# EAGLE design CMoy-Pro-V_2_0_0_0a (EAGLE 6.4)
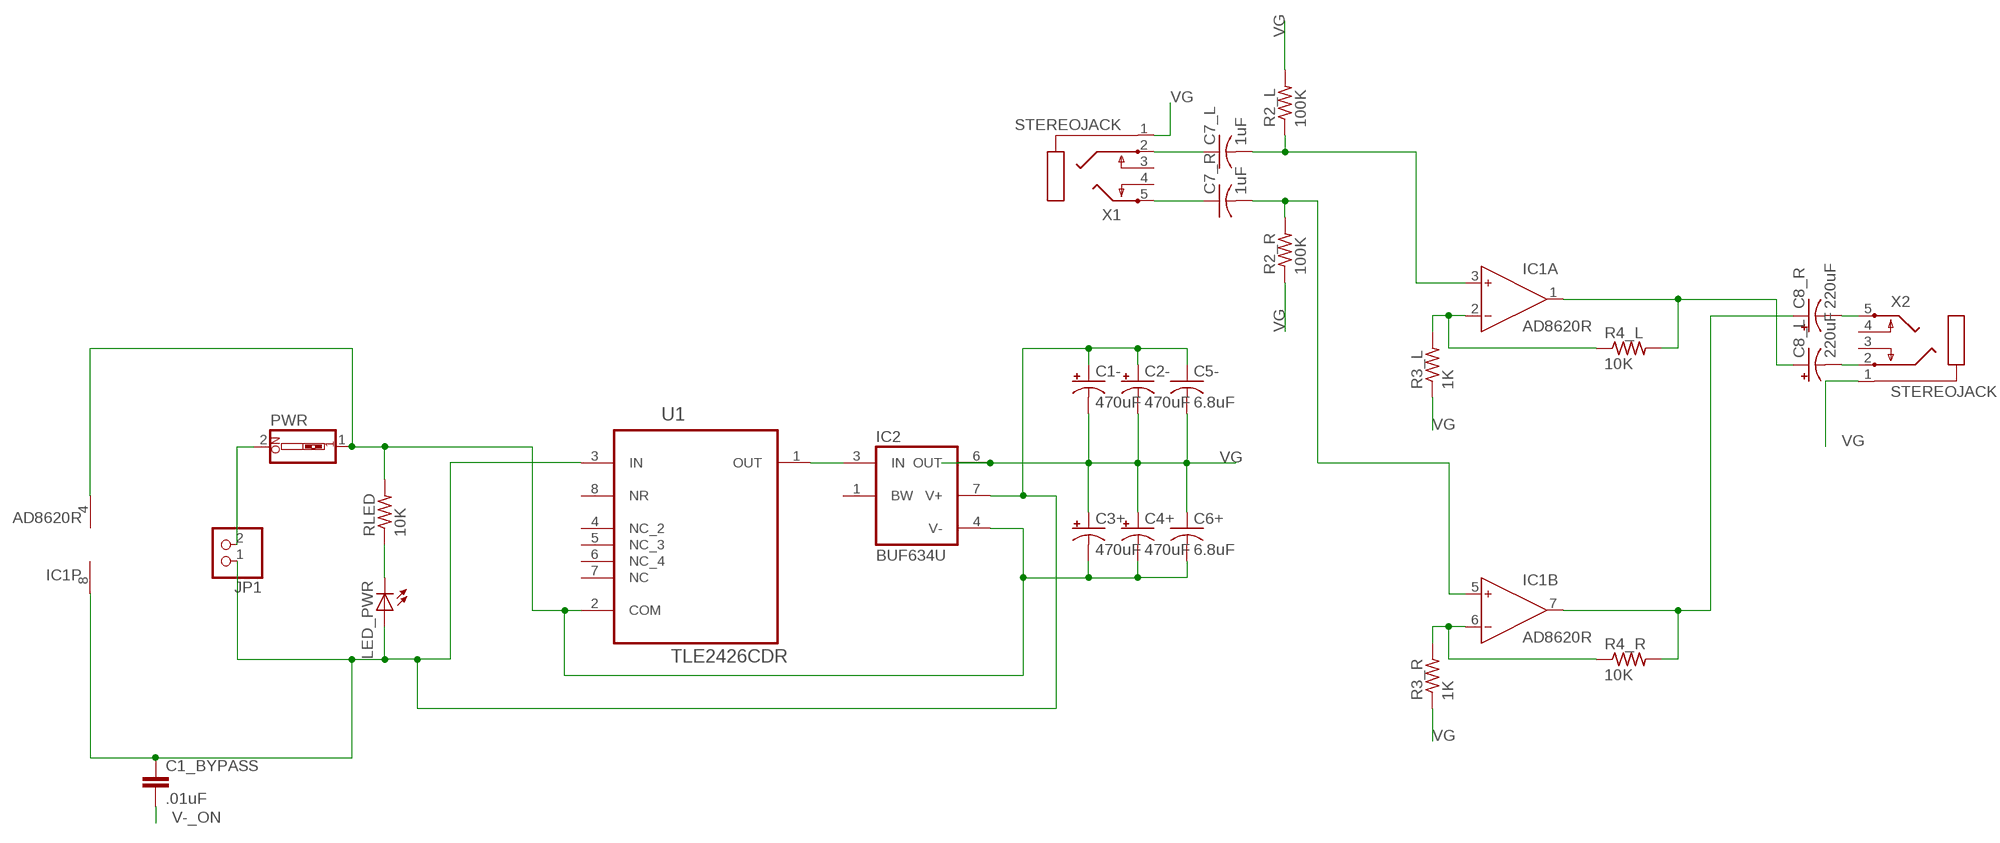
[diagram p0: schematic, sheet 1]

## Parts
C1-  470uF  CPOL-USE3.5-10  [E3,5-10]
C1_BYPASS  .01uF  C-EUC0402  [C0402]
C2-  470uF  CPOL-USE3.5-10  [E3,5-10]
C3+  470uF  CPOL-USE3.5-10  [E3,5-10]
C4+  470uF  CPOL-USE3.5-10  [E3,5-10]
C5-  6.8uF  C-US075-042X103  [C075-042X103]
C6+  6.8uF  C-US075-042X103  [C075-042X103]
C7_L  1uF  C-US075-042X103  [C075-042X103]
C7_R  1uF  C-US075-042X103  [C075-042X103]
C8_L  220uF  CPOL-USE3.5-10  [E3,5-10]
C8_R  220uF  CPOL-USE3.5-10  [E3,5-10]
IC1  AD8620R  [SO8]
IC2  BUF634U  [SO08]
JP1  PINHD-1X2  [1X02]
LED_PWR  LED3MM  [LED3MM]
PWR  SW_DIP-1  [EDG-01]
R2_L  100K  R-US_0207/7  [0207/7]
R2_R  100K  R-US_0207/7  [0207/7]
R3_L  1K  R-US_0207/7  [0207/7]
R3_R  1K  R-US_0207/7  [0207/7]
R4_L  10K  R-US_0207/7  [0207/7]
R4_R  10K  R-US_0207/7  [0207/7]
RLED  10K  R-US_0207/7  [0207/7]
U1  TLE2426CDR  [SOIC127P600X175-8N]
X1  STEREOJACK  [STX3100]
X2  STEREOJACK  [STX3100]

## Nets
IN_R: C7_R.2 IC1.5(B:IN+) R2_R.2
N$1: C7_L.2 IC1.3(A:IN+) R2_L.1
N$2: C8_L.- X2.2
N$3: LED_PWR.K(C) RLED.1
N$4: C7_L.1 X1.2
N$5: IC1.2(A:IN-) R3_L.2 R4_L.1
N$6: IC1.6(B:IN-) R3_R.2 R4_R.1
N$7: C7_R.1 X1.5
N$8: C8_R.- X2.5
N$9: IC2.3(IN) U1.1(OUT)
OUT_L: C8_L.+ IC1.1(A:OUT) R4_L.2
OUT_R: C8_R.+ IC1.7(B:OUT) R4_R.2
V+: C1-.+ C1_BYPASS.1 C2-.+ C5-.1 IC1.8(P:V+) IC2.7(V+) JP1.1 LED_PWR.A U1.3(IN)
V-: JP1.2 PWR.2
V-_ON: C1_BYPASS.2 C3+.- C4+.- C6+.2 IC1.4(P:V-) IC2.4(V-) PWR.1 RLED.2 U1.2(COM)
VG: C1-.- C2-.- C3+.+ C4+.+ C5-.2 C6+.1 IC2.6(OUT) R2_L.2 R2_R.1 R3_L.1 R3_R.1 X1.1 X2.1
Unconnected: IC2.1(BW) U1.4(NC_2) U1.5(NC_3) U1.6(NC_4) U1.7(NC) U1.8(NR) X1.3 X1.4 X2.3 X2.4

## Library data of the parts
C1- C2- C3+ C4+ C8_L C8_R = rcl:CPOL-US: POLARIZED CAPACITOR, American symbol
C1_BYPASS = rcl:C-EU: CAPACITOR, European symbol
C5- C6+ C7_L C7_R = rcl:C-US: CAPACITOR, American symbol
IC1 = analog-devices:AD8620: Precision, Very Low Noise, Low Input Bias Current, Wide Bandwidth JFET Operational Amplifiers Source: http://www.analog.com/static/imported-files/data_sheets/AD8610_8620.pdf; MF: ALTERA CORPORATION; MPN: AD8620ARZ; OC_FARNELL: 9994386; OC_NEWARK: 59K6972
IC2 = burr-brown:BUF634: 250mA High-Speed Buffer; MF: TEXAS INSTRUMENTS; MPN: BUF634U; OC_FARNELL: 4733617; OC_NEWARK: 27C6567
JP1 = pinhead:PINHD-1X2: PIN HEADER
LED_PWR = adafruit:LED: LED OSRAM: - CHIPLED LG R971, LG N971, LY N971, LG Q971, LY Q971, LO R971, LY R971 LH N974, LH R974 LS Q976, LO Q976, LY Q976 LO Q996 - Hyper CHIPLED LW Q18S LB Q993, LB Q99A, LB R99A - SideLED LS A670, LO A670, LY A670, LG A670, LP A670 LB A673, LV A673, LT A673, LW A673 LH A674 LY A675 LS A676, LA A676, LO A676, LY A676, LW A676 LS A679, LY A679, LG A679 - Hyper Micro SIDELED® LS Y876, LA Y876, LO Y876, LY Y876 LT Y87S - SmartLED LW L88C, LW L88S LB L89C, LB L89S, LG L890 LS L89K, LO L89K, LY L89K LS L896, LA L896, LO L896, LY L896 - TOPLED LS T670, LO T670, LY T670, LG T670, LP T670 LSG T670, LSP T670, LSY T670, LOP T670, LYG T670 LG T671, LOG T671, LSG T671 LB T673, LV T673, LT T673, LW T673 LH T674 LS T676, LA T676, LO T676, LY T676, LB T676, LH T676, LSB T676, LW T676 LB T67C, LV T67C, LT T67C, LS T67K, LO T67K, LY T67K, LW E67C LS E67B, LA E67B, LO E67B, LY E67B, LB E67C, LV E67C, LT E67C LW T67C LS T679, LY T679, LG T679 LS T770, LO T770, LY T770, LG T770, LP T770 LB T773, LV T773, LT T773, LW T773 LH T774 LS E675, LA E675, LY E675, LS T675 LS T776, LA T776, LO T776, LY T776, LB T776 LHGB T686 LT T68C, LB T68C - Hyper Mini TOPLED® LB M676 - Mini TOPLED Santana® LG M470 LS M47K, LO M47K, LY M47K Source: http://www.osram.convergy.de/
PWR = special:SW_DIP-1: DIP SWITCH
R2_L R2_R R3_L R3_R R4_L R4_R RLED = rcl:R-US_: RESISTOR, American symbol
U1 = Texas Instruments_By_element14_Batch_1:TLE2426CDR: Precision Virtual Ground; MPN: TLE2426CDR; OC_FARNELL: 1575632; OC_NEWARK: 76C7712; PACKAGE: SOIC-8; SUPPLIER: Texas Instruments
X1 X2 = adafruit:STEREOJACK: MIC/HEADPHONE JACK Stereo jack with two switches. Kycon STX3100, CUI SJ1-3555NG and/or 4UCon 05544

## Board
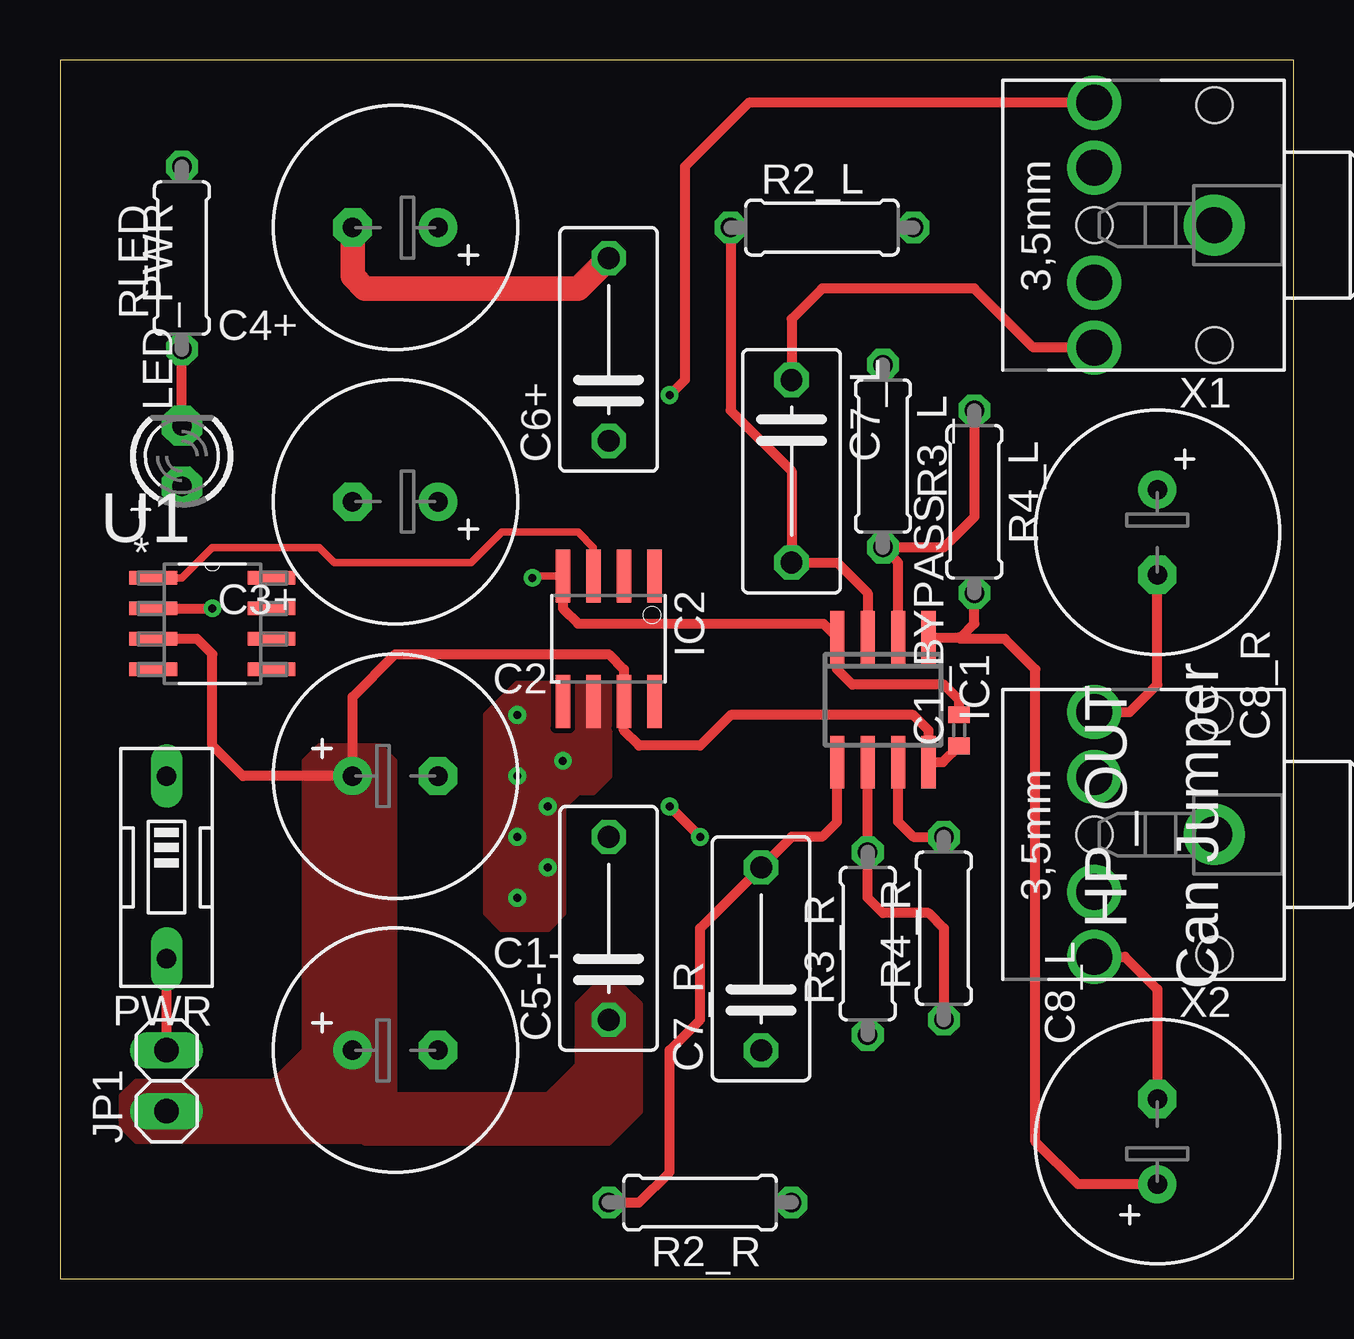
[diagram p1: board, top side]
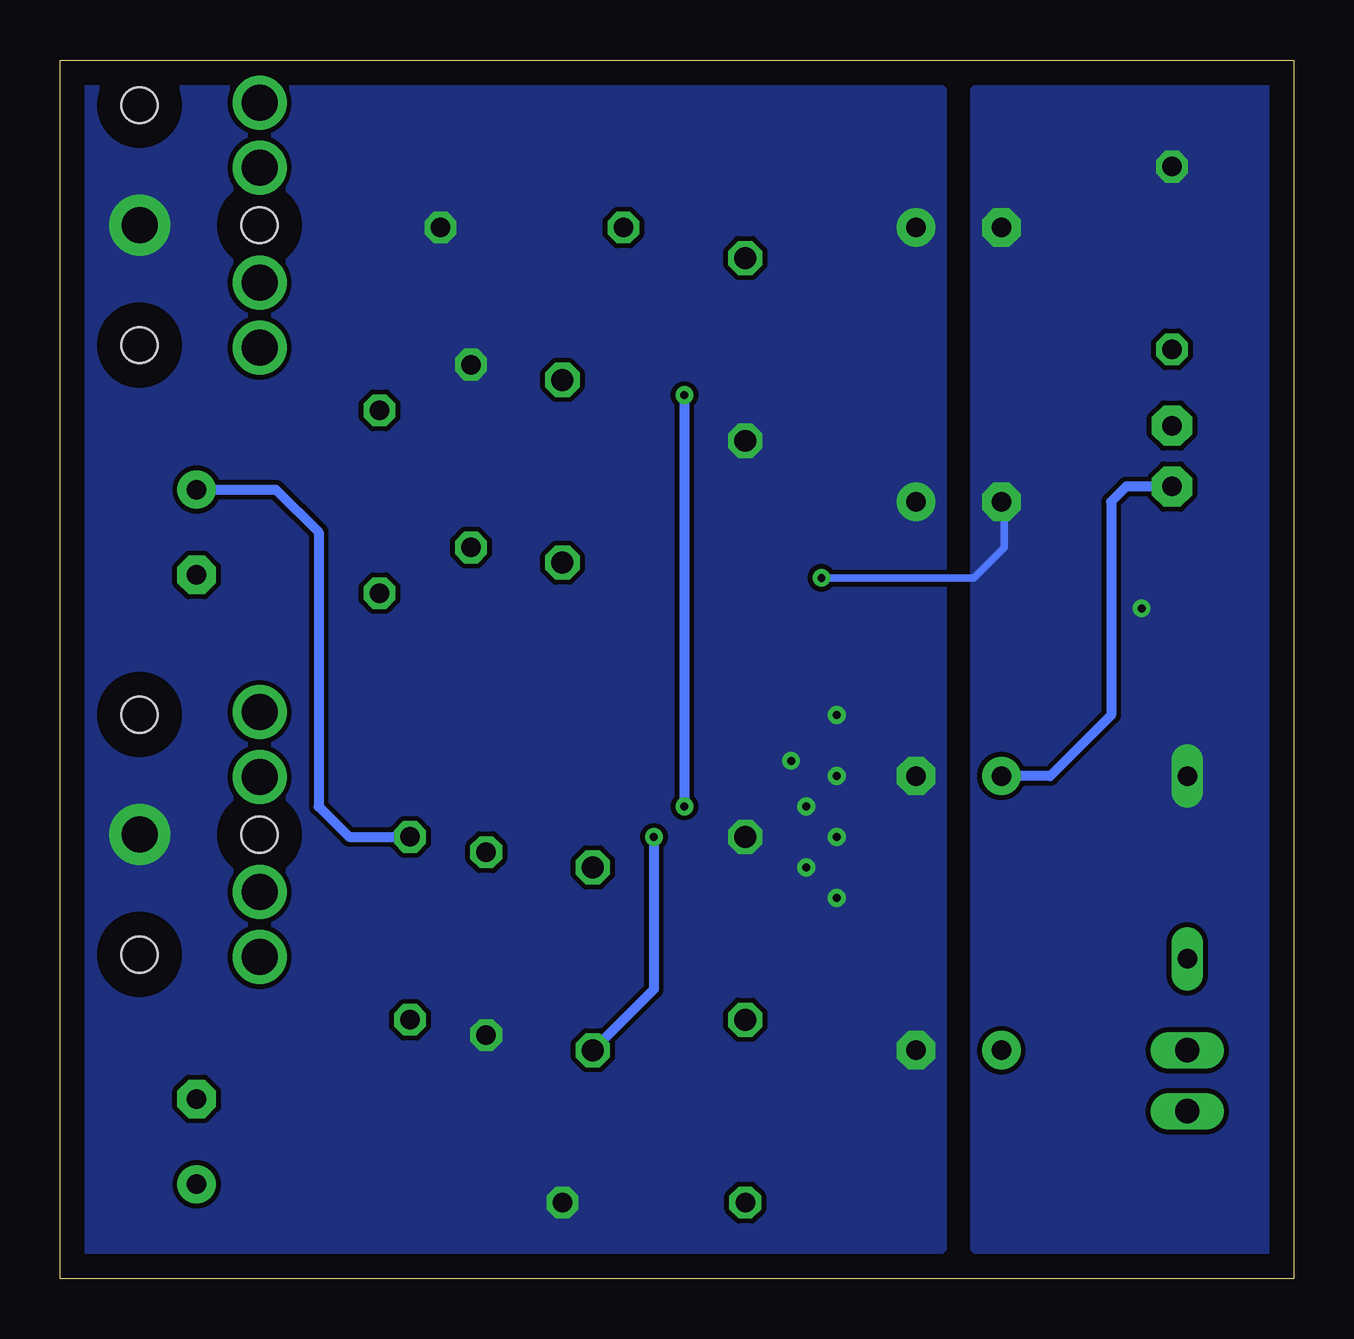
[diagram p2: board, bottom side, seen from below]

Size 51.42 x 50.8 mm. Coordinates in mm from the lower left corner, seen from the top.
Outline: 0,0 51.42,0 51.42,50.8 0,50.8 0,0
Copper layers (1*16): Top 0.035mm / dielectric 1.5mm / Bottom 0.035mm
Design rules "default": minimum track width 10mil, minimum drill 24mil, track to track 8mil, track to pad 8mil, pad to pad 8mil, via to via 8mil, smd to smd 8mil, copper to edge 40mil, drill to drill 8mil, minimum pad ring 10mil, minimum via ring 8mil, stop-mask expansion 4mil, vias tented up to drill 0mil, thermal gap 10mil

### Footprints (pad centres in the part's own frame; a part is rotated, then mirrored left to right if it is on the bottom)
E3,5-10 = drill 0.813 pad 1.6: + -1.778,0 | drill 0.813 pad 1.6 octagon: - 1.778,0
C0402 = smd 0.7 x 0.9: 1 -0.65,0; 2 0.65,0
C075-042X103 = drill 0.914 octagon: 1 -3.81,0; 2 3.81,0
SO8 = smd 0.6 x 2.2: 1 -1.905,-2.6; 2 -0.635,-2.6; 3 0.635,-2.6; 4 1.905,-2.6; 5 1.905,2.6; 6 0.635,2.6; 7 -0.635,2.6; 8 -1.905,2.6
SO08 = smd 0.61 x 2.21: 1 -1.905,-2.616; 2 -0.635,-2.616; 3 0.635,-2.616; 4 1.905,-2.616; 5 1.905,2.616; 6 0.635,2.616; 7 -0.635,2.616; 8 -1.905,2.616
1X02 = drill 1.016 long: 1 -1.27,0; 2 1.27,0
LED3MM = drill 0.813 pad 1.676 octagon: A -1.27,0; K 1.27,0
EDG-01 = drill 0.813 long: 1 0,-3.81; 2 0,3.81
0207/7 = drill 0.813 octagon: 1 -3.81,0; 2 3.81,0
SOIC127P600X175-8N = smd 1.981 x 0.559: 1 -2.464,1.905; 2 -2.464,0.635; 3 -2.464,-0.635; 4 -2.464,-1.905; 5 2.464,-1.905; 6 2.464,-0.635; 7 2.464,0.635; 8 2.464,1.905
STX3100 = drill 1.5 pad 2.54: 1 2.7,-0.1 | drill 1.5: 2 7.7,5; 3 7.7,2.3; 4 7.7,-2.5; 5 7.7,-5.2 | hole 1.5: 2.7,4.9; 2.7,-5.1; 7.7,-0.1

### Placement (x,y rotation side)
C1-  13.97,9.53 0 top
C1_BYPASS  37.47,22.86 90 top
C2-  13.97,20.95 0 top
C3+  13.97,32.39 180 top
C4+  13.97,43.81 180 top
C5-  22.86,14.61 90 top
C6+  22.86,38.73 90 top
C7_L  30.48,33.66 270 top
C7_R  29.21,13.34 90 top
C8_L  45.72,5.72 90 top
C8_R  45.72,31.12 270 top
IC1  34.29,24.13 180 top
IC2  22.86,26.67 180 top
JP1  4.45,8.26 90 top
LED_PWR  5.08,34.29 90 top
PWR  4.45,17.15 180 top
R2_L  31.75,43.81 0 top
R2_R  26.67,3.18 180 top
R3_L  34.29,34.29 270 top
R3_R  33.66,13.97 90 top
R4_L  38.1,32.39 270 top
R4_R  36.83,14.61 90 top
RLED  5.08,42.55 90 top
U1  6.35,27.31 0 top
X1  50.8,43.81 180 top
X2  50.8,18.42 180 top

### Tracks (layer width: path | path; a pad name or v marks a point on that pad's centre or on a via)
IN_R
  Top 0.406: IC1.5 32.39,19.05 31.75,18.42 30.48,18.42 C7_R.2 26.67,14.61 26.67,10.8 25.4,9.53 25.4,4.45 24.13,3.18 R2_R.2
N$1
  Top 0.406: IC1.3 33.66,28.58 32.39,29.84 C7_L.2 30.48,33.66 27.94,36.2 R2_L.1
N$2
  Top 0.406: X2.2 44.37,13.42 45.72,12.06 C8_L.-
N$3
  Top 0.406: LED_PWR.K RLED.1
N$4
  Top 0.406: X1.2 40.56,38.81 38.1,41.28 31.75,41.28 30.48,40.01 C7_L.1
N$5
  Top 0.406: R4_L.1 38.1,31.75 36.83,30.48 R3_L.2 34.92,29.84 IC1.2
N$6
  Top 0.406: IC1.6 R3_R.2 33.66,15.88 34.29,15.24 36.2,15.24 36.83,14.61 R4_R.1
N$7  (via drill 0.33)
  Top 0.406: X1.5 28.7,49.02 26.04,46.36 26.04,37.47 v25.4,36.83 | v25.4,19.69 v26.67,18.42
  Bottom 0.406: v26.67,18.42 26.67,12.06 C7_R.1 | v25.4,36.83 v25.4,19.69
N$8
  Top 0.406: X2.5 44.57,23.62 45.72,24.77 C8_R.-
N$9
  Top 0.305: U1.1 5.08,29.21 6.35,30.48 10.8,30.48 11.43,29.84 17.15,29.84 18.42,31.12 21.59,31.12 22.23,30.48 IC2.3
OUT_L
  Top 0.406: IC1.1 37.47,26.73 | 37.47,26.73 37.53,26.73 38.1,27.31 R4_L.2 | C8_L.+ 42.42,3.94 40.64,5.72 40.64,25.4 39.37,26.67 37.53,26.67 37.47,26.73
OUT_R
  Top 0.406: IC1.7 34.92,19.05 35.56,18.42 R4_R.2
  Bottom 0.406: C8_R.+ 42.42,32.89 40.64,31.12 40.64,19.69 39.37,18.42 R4_R.2
V+
  Top 0.406: U1.3 5.72,26.67 6.35,26.03 6.35,22.23 7.62,20.95 C2-.+ 12.19,24.26 13.97,26.03 22.86,26.03 23.5,25.4 IC2.7 23.5,22.86 24.13,22.23 26.67,22.23 27.94,23.5 35.56,23.5 36.2,22.86 IC1.8 36.79,21.53 C1_BYPASS.1
  Bottom 0.406: LED_PWR.A 6.98,33.02 7.62,32.39 7.62,23.5 10.16,20.95 C2-.+
  pour Top (no thermals): 5.08,8.26 3.17,8.26 2.54,7.62 2.54,6.35 3.17,5.72 12.7,5.72 13.97,6.98 13.97,21.59 13.34,22.23 10.8,22.23 10.16,21.59 10.16,9.53 8.89,8.26
  pour Top (no thermals): 12.7,10.8 11.43,10.8 11.43,6.98 12.7,5.72 22.86,5.72 24.13,6.98 24.13,11.43 23.5,12.06 22.23,12.06 21.59,11.43 21.59,8.89 20.32,7.62 13.34,7.62 12.7,8.26
V-
  Top 0.406: JP1.2 PWR.2
V-_ON  (via drill 0.33)
  Top 0.305: IC2.4 19.76,29.29 v19.69,29.21
  Top 0.406: U1.2 v6.35,27.94 | C1_BYPASS.2 37.47,24.13 36.83,24.77 33.02,24.77 32.39,25.4 IC1.4 31.81,27.31 21.59,27.31 20.95,27.94 IC2.4
  Top 1.016: C4+.- 12.19,41.78 12.7,41.28 21.59,41.28 C6+.2
  Bottom 0.305: v19.69,29.21 13.34,29.21 12.06,30.48 12.06,32.26 C3+.-
  pour Bottom (no thermals): 0.64,50.17 12.7,50.17 13.34,49.53 13.34,1.27 12.7,0.64 0.64,0.64
VG  (via drill 0.33)
  other vias: 19.05,23.5 19.05,15.88 20.32,17.15 19.05,18.42 20.32,19.69 20.95,21.59 19.05,20.95
  pour Bottom (no thermals): 15.24,50.17 14.61,49.53 14.61,1.27 15.24,0.64 50.8,0.64 50.8,50.17
  pour Top (no thermals): 22.86,24.77 19.05,24.77 17.78,23.5 17.78,15.24 18.42,14.61 20.32,14.61 20.95,15.24 20.95,19.69 21.59,20.32 22.23,20.32 22.86,20.95

### Text on the board
tPlace: HP_OUT | Can Jumper